# Altium project DIY_EINK_Gadget.PrjPcb
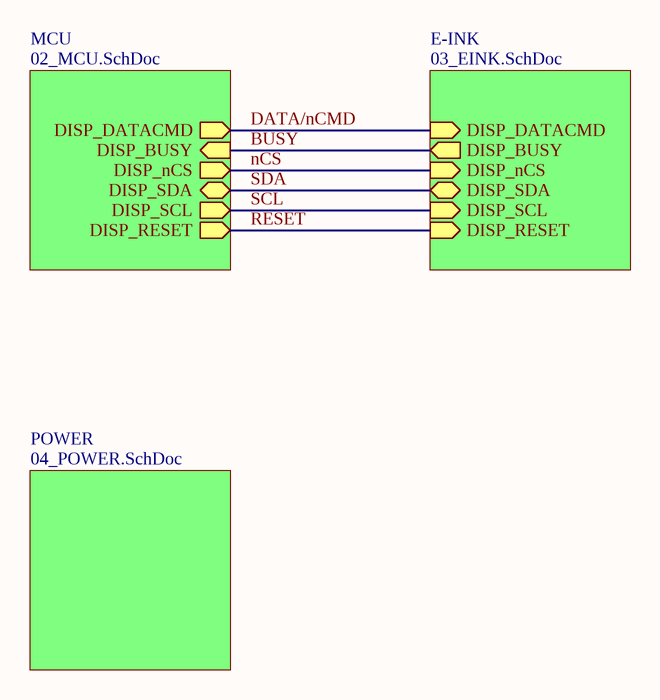
[diagram p0: 01_TOP.SchDoc]
4 sheets, 65 parts. Net scope: hierarchical (ports join the sheet entries above them; power ports are global).
Board file: DIY_EINK_Gadget.PcbDoc
Sheets:
  01_TOP.SchDoc
    MCU = 02_MCU.SchDoc
    E-INK = 03_EINK.SchDoc
    POWER = 04_POWER.SchDoc

## Sheet 01_TOP.SchDoc
size A4; Author: Sasa Karanovic; Organization: Altium Limited; DocumentNumber: 1; SheetNumber: 1; SheetTotal: 4; sk_ProjectName: DIY E-Ink Gadget; sk_title: Top page

### Sub-sheets
E-INK = 03_EINK.SchDoc: DISP_RESET (in), DISP_BUSY (out), DISP_DATACMD (in), DISP_nCS (in), DISP_SDA (bidir), DISP_SCL (in)
MCU = 02_MCU.SchDoc: DISP_SCL (out), DISP_nCS (out), DISP_BUSY (in), DISP_SDA (bidir), DISP_DATACMD (out), DISP_RESET (out)
POWER = 04_POWER.SchDoc: no entries

### Nets
BUSY: sheet MCU/DISP_BUSY, sheet E-INK/DISP_BUSY
DATA/nCMD: sheet MCU/DISP_DATACMD, sheet E-INK/DISP_DATACMD
nCS: sheet MCU/DISP_nCS, sheet E-INK/DISP_nCS
RESET: sheet MCU/DISP_RESET, sheet E-INK/DISP_RESET
SCL: sheet MCU/DISP_SCL, sheet E-INK/DISP_SCL
SDA: sheet MCU/DISP_SDA, sheet E-INK/DISP_SDA

### Notes on the sheet
- Page
- Title
- www.SasaKaranovic.com <http://www.SasaKaranovic.com>
- of

## Sheet 02_MCU.SchDoc
size A4; Author: Sasa Karanovic; Organization: Altium Limited; DocumentNumber: 1; SheetNumber: 2; SheetTotal: 4; sk_ProjectName: DIY E-Ink Gadget; sk_title: Microcontroller
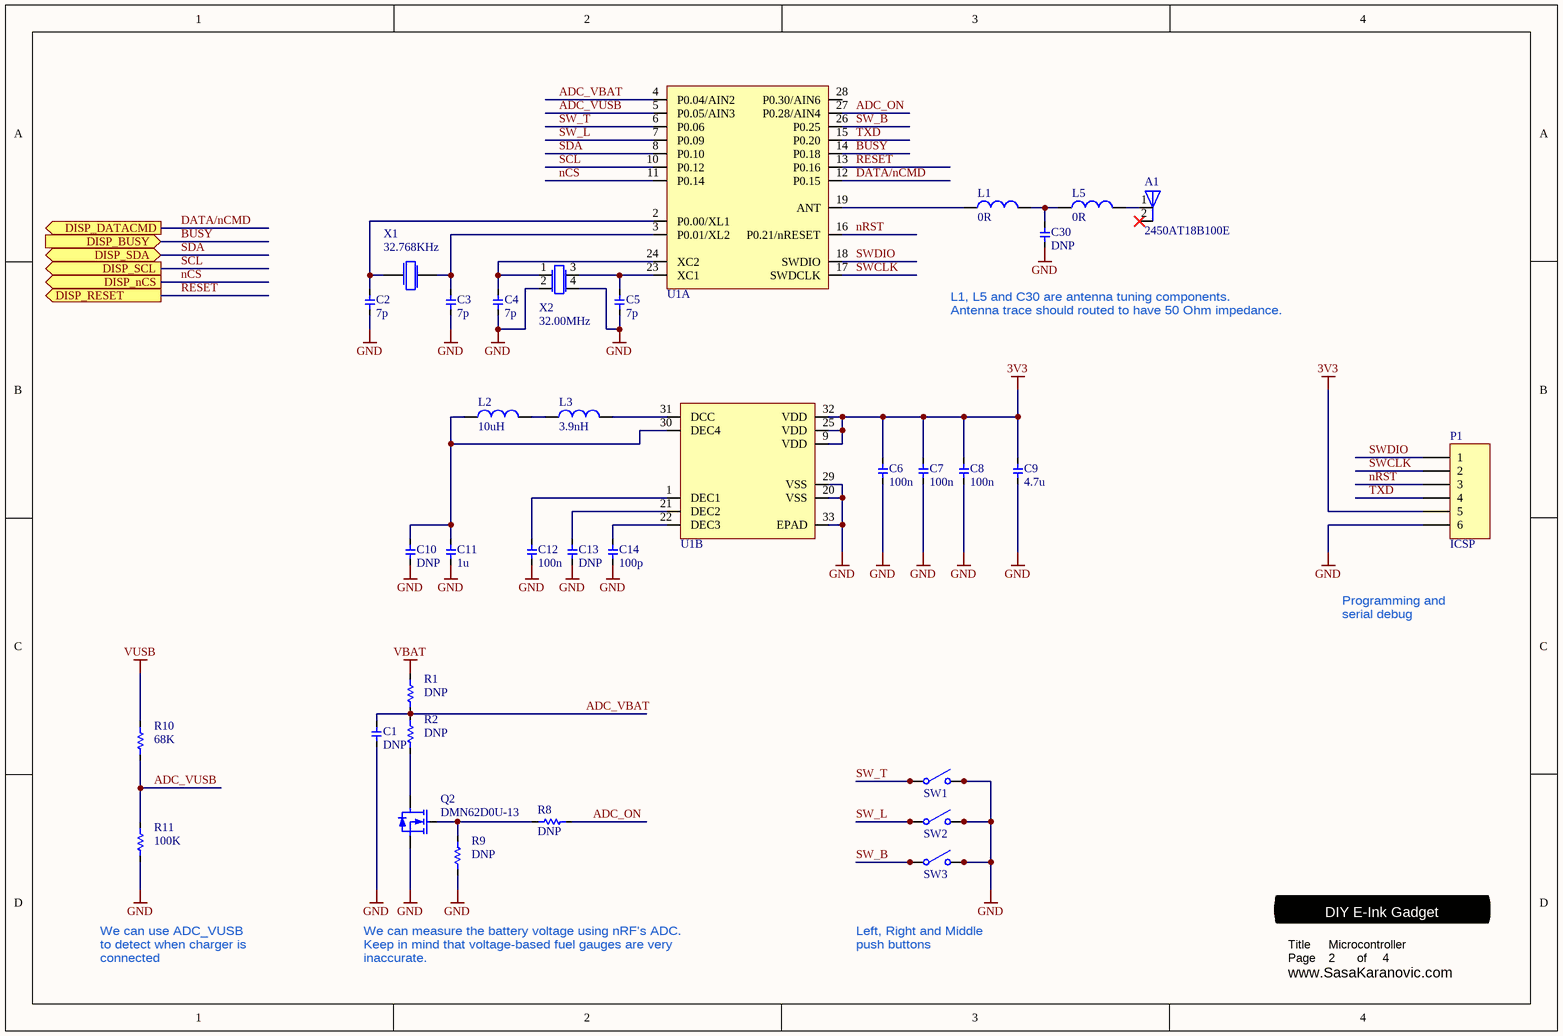
[diagram p1: 02_MCU.SchDoc]

### Parts
A1  2450AT18B100E  [2450AT18B100]
C1  value DNP  [0603 - CAP]  (hidden comment: Cap)  (no BOM)
C2  value 7p  [0603 - CAP]  (hidden comment: Cap)
C3  value 7p  [0603 - CAP]  (hidden comment: Cap)
C4  value 7p  [0603 - CAP]  (hidden comment: Cap)
C5  value 7p  [0603 - CAP]  (hidden comment: Cap)
C6  value 100n  [0603 - CAP]  (hidden comment: Cap)
C7  value 100n  [0603 - CAP]  (hidden comment: Cap)
C8  value 100n  [0603 - CAP]  (hidden comment: Cap)
C9  value 4.7u  [0603 - CAP]  (hidden comment: Cap)
C10  value DNP  [0603 - CAP]  (hidden comment: Cap)  (no BOM)
C11  value 1u  [0603 - CAP]  (hidden comment: Cap)
C12  value 100n  [0603 - CAP]  (hidden comment: Cap)
C13  value DNP  [0603 - CAP]  (hidden comment: Cap)  (no BOM)
C14  value 100p  [0603 - CAP]  (hidden comment: Cap)
C30  value DNP  [0603 - CAP]  (hidden comment: Cap)  (no BOM)
L1  value 0R  [0603_IND]  (hidden comment: Inductor)
L2  value 10uH  [0603_IND]  (hidden comment: Inductor)
L3  value 3.9nH  [0603_IND]  (hidden comment: Inductor)
L5  value 0R  [0603_IND]  (hidden comment: Inductor)
P1  ICSP  [Header 6x1 M - 90Deg - SMT]  (no BOM)
Q2  DMN62D0U-13  [SOT90P240X100-3N]  (no BOM)
R1  value DNP  [0603]  (hidden comment: Res)  (no BOM)
R2  value DNP  [0603]  (hidden comment: Res)  (no BOM)
R8  value DNP  [0603]  (hidden comment: Res)  (no BOM)
R9  value DNP  [0603]  (hidden comment: Res)  (no BOM)
R10  value 68K  [0603]  (hidden comment: Res)
R11  value 100K  [0603]  (hidden comment: Res)
SW1  SWITCH TACTILE SPST-NO 0.05A 12V  [PTS645]  (value not drawn)
SW2  SWITCH TACTILE SPST-NO 0.05A 12V  [PTS645]  (value not drawn)
SW3  SWITCH TACTILE SPST-NO 0.05A 12V  [PTS645]  (value not drawn)
U1  NRF52810-QCAA-R  [QFN50P500X500X100_HS-33N]  (value not drawn)  (parts A,B of 2)
X1  32.768KHz  [XTAL-2LEAD-3215]
X2  32.00MHz  [XTAL-4LEAD-2016]

### Ports
DISP_BUSY (in), DISP_DATACMD (out), DISP_nCS (out), DISP_RESET (out), DISP_SCL (out), DISP_SDA (bidir)

### Nets
3V3: C6.2 C7.2 C8.2 C9.2 P1.5 U1.9(VDD) U1.25(VDD) U1.32(VDD)
GND: C1.1 C2.1 C3.1 C4.1 C5.1 C6.1 C7.1 C8.1 C9.1 C10.1 C11.1 C12.1 C13.1 C14.1 C30.1 P1.6 Q2.2(S) R9.1 R11.1 SW1.3(COMMON2) SW1.4(COMMON2) SW2.3(COMMON2) SW2.4(COMMON2) SW3.3(COMMON2) SW3.4(COMMON2) U1.20(VSS) U1.29(VSS) U1.33(EPAD) X2.2(GND) X2.4(GND)
VBAT: R1.2
VUSB: R10.2
ADC_ON: R8.1 U1.27(P0.28/AIN4)
ADC_VBAT: C1.2 R1.1 R2.2 U1.4(P0.04/AIN2)
ADC_VUSB: R10.1 R11.2 U1.5(P0.05/AIN3)
BUSY: U1.14(P0.18) ; port DISP_BUSY
DATA/nCMD: U1.12(P0.15) ; port DISP_DATACMD
nCS: U1.11(P0.14) ; port DISP_nCS
nRST: P1.3 U1.16(P0.21/nRESET)
RESET: U1.13(P0.16) ; port DISP_RESET
SCL: U1.10(P0.12) ; port DISP_SCL
SDA: U1.8(P0.10) ; port DISP_SDA
SW_B: SW3.1(COMMON1) SW3.2(COMMON1) U1.26(P0.25)
SW_L: SW2.1(COMMON1) SW2.2(COMMON1) U1.7(P0.09)
SW_T: SW1.1(COMMON1) SW1.2(COMMON1) U1.6(P0.06)
SWCLK: P1.2 U1.17(SWDCLK)
SWDIO: P1.1 U1.18(SWDIO)
TXD: P1.4 U1.15(P0.20)
NetA1_1: A1.1(FEED) L5.2
NetC2_2: C2.2 U1.2(P0.00/XL1) X1.1
NetC3_2: C3.2 U1.3(P0.01/XL2) X1.2
NetC4_2: C4.2 U1.24(XC2) X2.1(OSC1)
NetC5_2: C5.2 U1.23(XC1) X2.3(OSC3)
NetC10_2: C10.2 C11.2 L2.1 U1.30(DEC4)
NetC12_2: C12.2 U1.1(DEC1)
NetC13_2: C13.2 U1.21(DEC2)
NetC14_2: C14.2 U1.22(DEC3)
NetC30_2: C30.2 L1.2 L5.1
NetL1_1: L1.1 U1.19(ANT)
NetL2_2: L2.2 L3.1
NetL3_2: L3.2 U1.31(DCC)
NetQ2_1: Q2.1(G) R8.2 R9.2
NetQ2_3: Q2.3(D) R2.1

Not connected (* = marked no-connect by the designer): A1 2(NC)*; U1 28(_P0.30/AIN6)

### Notes on the sheet
- L1, L5 and C30 are antenna tuning components.
  Antenna trace should routed to have 50 Ohm impedance.
- Programming and serial debug
- We can use ADC_VUSB to detect when charger is connected
- We can measure the battery voltage using nRF's ADC.
  Keep in mind that voltage-based fuel gauges are very inaccurate.
- Left, Right and Middle push buttons
- Page
- Title
- www.SasaKaranovic.com <http://www.SasaKaranovic.com>
- of

### Library data of the parts
A1 = 2450AT18B100E: 2.4GHz - Chip RF Antenna 2.4GHz ~ 2.5GHz 0.5dBi Solder Surface Mount; Manufacturer: Johanson Technology Inc.; Manufacturer Part Number: 2450AT18B100E; Distributor: DigiKey; Distributor Part Number: 712-1006-1-ND
C1 C10 C13 C30 = Cap: Capacitor
C2-C5 = Cap: Capacitor; Manufacturer: Samsung Electro-Mechanics; Manufacturer Part Number: CL10C070DB8NNNC; Distributor Part Number: 1276-2138-1-ND; Distributor: DigiKey
C6-C8 C12 = Cap: Capacitor; Manufacturer: Samsung Electro-Mechanics; Manufacturer Part Number: CL10B104KB8NNWC; Distributor Part Number: 1276-1935-1-ND; Distributor: DigiKey
C9 = Cap: Capacitor; Manufacturer: Samsung Electro-Mechanics; Manufacturer Part Number: CL10B475KQ8NQNC; Distributor Part Number: 1276-2087-1-ND; Distributor: DigiKey
C11 = Cap: Capacitor; Manufacturer: Samsung Electro-Mechanics; Manufacturer Part Number: CL10B105KA8VPNC; Distributor Part Number: 1276-6617-1-ND; Distributor: DigiKey
C14 = Cap: Capacitor; Manufacturer: Samsung Electro-Mechanics; Manufacturer Part Number: CL10C101JB8NNNC; Distributor Part Number: 1276-1008-1-ND; Distributor: DigiKey
L1 L5 = Inductor: Manufacturer: YAGEO; Manufacturer Part Number: RC0603FR-070RL; Distributor: DigiKey; Distributor Part Number: 311-0.0HRCT-ND
L2 = Inductor: Manufacturer: Abracon LLC; Manufacturer Part Number: ASMCI-0603-100M-T; Distributor: DigiKey; Distributor Part Number: 535-12249-1-ND
L3 = Inductor: Manufacturer: Abracon LLC; Manufacturer Part Number: AIMC-0603-3N9S-T; Distributor: DigiKey; Distributor Part Number: 535-11540-1-ND
P1 = Header 6: Header, 6-Pin
Q2 = DMN62D0U-13: MOSFET N-CH 60V 0.38A; Manufacturer: Diodes Incorporated; Manufacturer Part Number: DMN62D0U-13; Distributor: DigiKey; Distributor Part Number: DMN62D0U-13DICT-ND
R1 R2 R8 R9 = Res: Resistor
R10 = Res: Resistor; Manufacturer: YAGEO; Manufacturer Part Number: RC0603FR-0768KL; Distributor: DigiKey; Distributor Part Number: 311-68.0KHRCT-ND
R11 = Res: Resistor; Manufacturer: YAGEO; Manufacturer Part Number: RC0603FR-07100KL; Distributor: DigiKey; Distributor Part Number: 311-100KHRCT-ND
SW1-SW3 = PTS645SL50SMTR92 LFS: Manufacturer: C&K; Distributor Part Number: CKN9088CT-ND; Manufacturer Part Number: PTS645SL50SMTR92 LFS; Distributor: DigiKey
U1 = NRF52810-QCAA-R: IC RF TxRx + MCU Bluetooth Bluetooth v5.0 2.4GHz 32-VFQFN Exposed Pad; Manufacturer: Nordic Semiconductor ASA; Manufacturer Part Number: NRF52810-QCAA-R; Distributor: DigiKey; Distributor Part Number: 1490-NRF52810-QCAA-RCT-ND
X1 = XTAL-32.768KHz-SC32S-7PF20PPM: 32.768 kHz ±20ppm Crystal 7pF 70 kOhms 2-SMD, No Lead; Manufacturer: ECS Inc.; Manufacturer Part Number: ECS-320-8-37B-CKY-TR; Distributor: DigiKey; Distributor Part Number: XC3067CT-ND
X2 = XTAL-32MHz-ECS-320-8-37B-CKY-TR: 32 MHz ±10ppm Crystal 8pF 50 Ohms 4-SMD, No Lead; Manufacturer: ECS Inc.; Manufacturer Part Number: ECS-320-8-37B-CKY-TR; Distributor: DigiKey; Distributor Part Number: XC3067CT-ND

## Sheet 03_EINK.SchDoc
size A4; Author: Sasa Karanovic; Organization: Altium Limited; DocumentNumber: 1; SheetNumber: 3; SheetTotal: 4; sk_ProjectName: DIY E-Ink Gadget; sk_title: E-Ink Driving Circuit
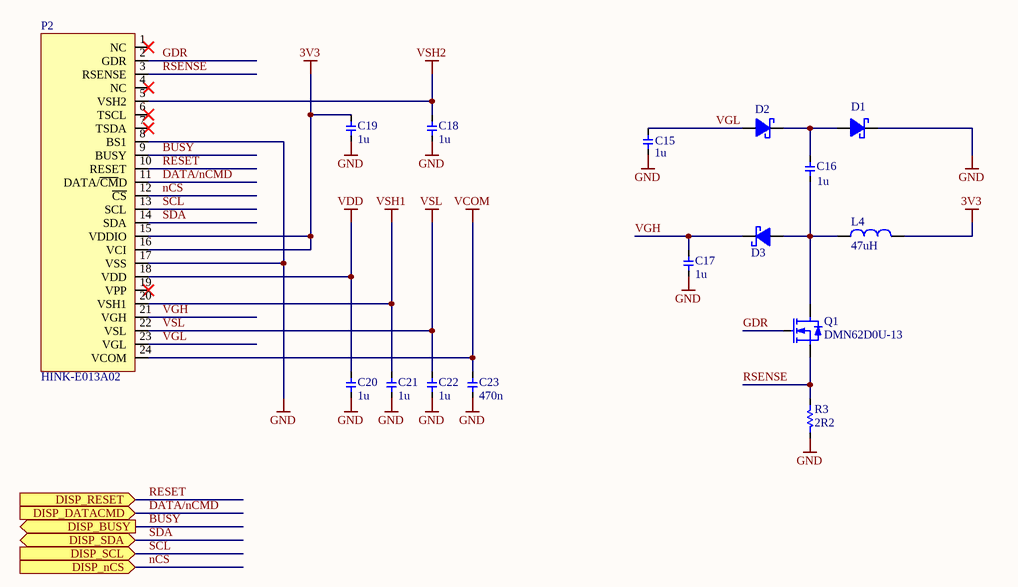
[diagram p2: 03_EINK.SchDoc]

### Parts
C15  value 1u  [0603 - CAP HS]  (hidden comment: Cap)
C16  value 1u  [0603 - CAP HS]  (hidden comment: Cap)
C17  value 1u  [0603 - CAP HS]  (hidden comment: Cap)
C18  value 1u  [0603 - CAP HS]  (hidden comment: Cap)
C19  value 1u  [0603 - CAP HS]  (hidden comment: Cap)
C20  value 1u  [0603 - CAP HS]  (hidden comment: Cap)
C21  value 1u  [0603 - CAP HS]  (hidden comment: Cap)
C22  value 1u  [0603 - CAP HS]  (hidden comment: Cap)
C23  value 470n  [0603 - CAP HS]  (hidden comment: Cap)
D1  Diode Schotky  [SOD123F]  (value not drawn)
D2  Diode Schotky  [SOD123F]  (value not drawn)
D3  Diode Schotky  [SOD123F]  (value not drawn)
L4  value 47uH  [IND_5050]  (hidden comment: Inductor)
P2  HINK-E013A02  [SFV24R-1STE1HLF]
Q1  DMN62D0U-13  [SOT90P240X100-3N]
R3  value 2R2  [0603 - HS]  (hidden comment: Res)

### Ports
DISP_BUSY (out), DISP_DATACMD (in), DISP_nCS (in), DISP_RESET (in), DISP_SCL (in), DISP_SDA (bidir)

### Nets
3V3: C19.2 L4.1 P2.15(VDDIO) P2.16(VCI)
GND: C15.2 C17.2 C18.1 C19.1 C20.1 C21.1 C22.1 C23.1 D1.K P2.8(BS1) P2.17(VSS) R3.2
VCOM: C23.2 P2.24(VCOM)
VDD: C20.2 P2.18(VDD)
VSH1: C21.2 P2.20(VSH1)
VSH2: C18.2 P2.5(VSH2)
VSL: C22.2 P2.22(VSL)
BUSY: P2.9(BUSY) ; port DISP_BUSY
DATA/nCMD: P2.11(DATA/~{CM}D) ; port DISP_DATACMD
GDR: P2.2(GDR) Q1.1(G)
nCS: P2.12(~{CS}) ; port DISP_nCS
RESET: P2.10(RESET) ; port DISP_RESET
RSENSE: P2.3(RSENSE) Q1.2(S) R3.1
SCL: P2.13(SCL) ; port DISP_SCL
SDA: P2.14(SDA) ; port DISP_SDA
VGH: C17.1 D3.K P2.21(VGH)
VGL: C15.1 D2.A P2.23(VGL)
NetC16_1: C16.1 D3.A L4.2 Q1.3(D)
NetC16_2: C16.2 D1.A D2.K

Not connected (* = marked no-connect by the designer): P2 1(NC)* 4(NC)* 6(TSCL)* 7(TSDA)* 19(VPP)*

### Notes on the sheet
- Page
- Title
- www.SasaKaranovic.com <http://www.SasaKaranovic.com>
- of

### Library data of the parts
C15-C22 = Cap: as C11 on sheet 02_MCU; Distributor Part Number: 1276-6617-1-ND; Distributor: DigiKey
C23 = Cap: Capacitor; Manufacturer: Samsung Electro-Mechanics; Manufacturer Part Number: CL10B474KA8NNNC; Distributor Part Number: 1276-2083-1-ND; Distributor: DigiKey
D1-D3 = Diode Schotky: Manufacturer: onsemi; Manufacturer Part Number: NRVB130LSFT1G; Distributor: DigiKey; Distributor Part Number: NRVB130LSFT1GOSCT-ND
L4 = Inductor: Manufacturer: TDK Corporation; Manufacturer Part Number: VLCF5024T-470MR40-2; Distributor: DigiKey; Distributor Part Number: 445-8747-1-ND
P2 = SFV24R-1STE1HLF: Manufacturer: Amphenol ICC (FCI); Manufacturer Part Number: SFV24R-4STE1HLF; Distributor: DigiKey; Distributor Part Number: 609-SFV24R-4STE1HLFCT-ND
Q1 = DMN62D0U-13: as Q2 on sheet 02_MCU; Manufacturer Part Number: DMN62D0U-13; Distributor: DigiKey; Distributor Part Number: DMN62D0U-13DICT-ND
R3 = Res: Resistor; Manufacturer: YAGEO; Manufacturer Part Number: RC0603FR-072R2L; Distributor: DigiKey; Distributor Part Number: 311-2.2HRCT-ND

## Sheet 04_POWER.SchDoc
size A4; Author: Sasa Karanovic; Organization: Altium Limited; DocumentNumber: 1; SheetNumber: 4; SheetTotal: 4; sk_ProjectName: DIY E-Ink Gadget; sk_title: Power and Battery Charging
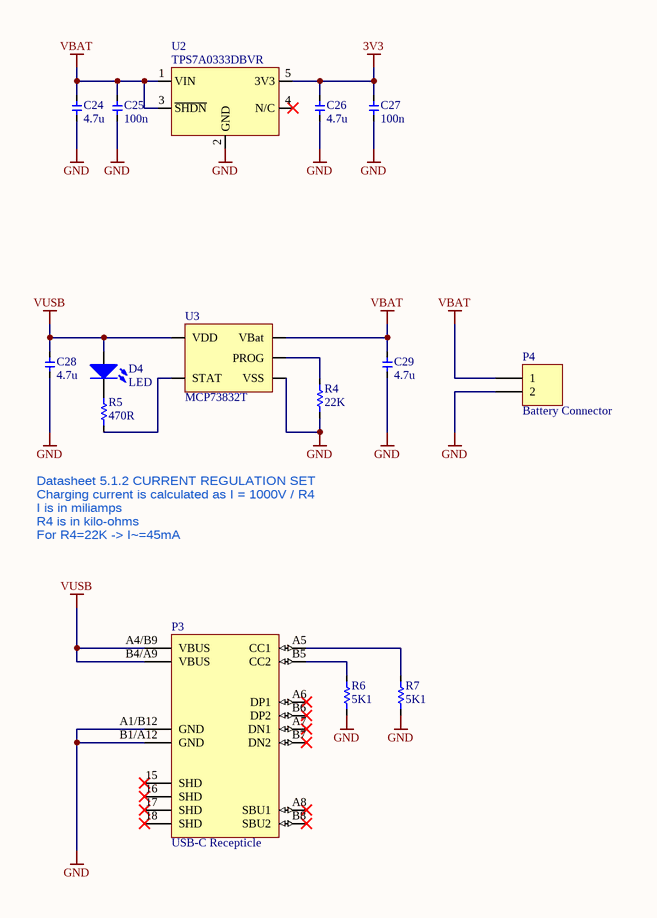
[diagram p3: 04_POWER.SchDoc]

### Parts
C24  value 4.7u  [0603 - CAP HS]  (hidden comment: Cap)
C25  value 100n  [0603 - CAP HS]  (hidden comment: Cap)
C26  value 4.7u  [0603 - CAP HS]  (hidden comment: Cap)
C27  value 100n  [0603 - CAP HS]  (hidden comment: Cap)
C28  value 4.7u  [0603 - CAP HS]  (hidden comment: Cap)
C29  value 4.7u  [0603 - CAP HS]  (hidden comment: Cap)
D4  LED  [0603 Diode]
P3  USB-C Recepticle  [GCT_USB4105-GF-A]
P4  Battery Connector  [Header 2x1 SMD]  (no BOM)
R4  value 22K  [0603]  (hidden comment: Res)
R5  value 470R  [0603]  (hidden comment: Res)
R6  value 5K1  [0603]  (hidden comment: Res)
R7  value 5K1  [0603]  (hidden comment: Res)
U2  TPS7A0333DBVR  [SOT-23-5]
U3  MCP73832T  [SOT-23-5]

### Nets
3V3: C26.1 C27.1 U2.5(3V3)
GND: C24.2 C25.2 C26.2 C27.2 C28.2 C29.2 P3.A1/B12(GND) P3.B1/A12(GND) P4.2 R4.1 R6.1 R7.1 U2.2(GND) U3.2(VSS)
VBAT: C24.1 C25.1 C29.1 P4.1 U2.1(VIN) U2.3(~{SHDN}) U3.3(VBat)
VUSB: C28.1 D4.A P3.A4/B9(VBUS) P3.B4/A9(VBUS) U3.4(VDD)
NetD4_K: D4.K R5.2
NetP3_A5: P3.A5(CC1) R7.2
NetP3_B5: P3.B5(CC2) R6.2
NetR4_2: R4.2 U3.5(PROG)
NetR5_1: R5.1 U3.1(STAT)

Not connected (* = marked no-connect by the designer): P3 15(SHD)* 16(SHD)* 17(SHD)* 18(SHD)* A6(DP1)* A7(DN1)* A8(SBU1)* B6(DP2)* B7(DN2)* B8(SBU2)*; U2 4(N/C)*

### Notes on the sheet
- Datasheet 5.1.2 CURRENT REGULATION SET
  Charging current is calculated as I = 1000V / R4
  I is in miliamps
  R4 is in kilo-ohms
  For R4=22K -> I~=45mA
- Page
- Title
- www.SasaKaranovic.com <http://www.SasaKaranovic.com>
- of

### Library data of the parts
C24 C26 C28 C29 = Cap: as C9 on sheet 02_MCU; Distributor Part Number: 1276-2087-1-ND; Distributor: DigiKey
C25 C27 = Cap: as C6 on sheet 02_MCU; Distributor Part Number: 1276-1935-1-ND; Distributor: DigiKey
D4 = LED: Typical RED GaAs LED; Manufacturer: Lite-On Inc.; Manufacturer Part Number: LTST-C193KRKT-5A; Distributor: DigiKey; Distributor Part Number: Lite-On Inc.
P3 = USB-C Recepticle: CONN RCPT USB2.0 TYPEC 5A; Manufacturer: GCT; Manufacturer Part Number: USB4105-GF-A; Distributor Part Number: 2073-USB4105-GF-ACT-ND; Distributor: DigiKey
P4 = Header 2: Header, 2-Pin
R4 = Res: Resistor; Manufacturer: YAGEO; Manufacturer Part Number: AC0603FR-1022KL; Distributor: DigiKey; Distributor Part Number: 13-AC0603FR-1022KLCT-ND
R5 = Res: Resistor; Manufacturer: YAGEO; Manufacturer Part Number: RC0603FR-10470RL; Distributor: DigiKey; Distributor Part Number: 13-RC0603FR-10470RLCT-ND
R6 R7 = Res: Resistor; Manufacturer: YAGEO; Manufacturer Part Number: RC0603FR-135K1L; Distributor: DigiKey; Distributor Part Number: 13-RC0603FR-135K1LCT-ND
U2 = NCP161ASN330T1G: Linear Voltage Regulator IC  1 Output  450mA SOT-23-5; Manufacturer: ON Semiconductor; Distributor: DigiKey; Distributor Part Number: NCP161ASN330T1GOSCT-ND; Manufacturer Part Number: NCP161ASN330T1G
U3 = MCP73832: 1xLi-Ion char, 0.5A, 4.2V reg, 3.75-6V; Manufacturer: Microchip Technology; Manufacturer Part Number: MCP73832T-2ACI/OT; Distributor: DigiKey; Distributor Part Number: MCP73832T-2ACI/OTCT-ND

## Nets that join several sheets
3V3: 02_MCU (8 pins), 03_EINK (C19.2 L4.1 P2.15 P2.16), 04_POWER (C26.1 C27.1 U2.5)
GND: 02_MCU (30 pins), 03_EINK (12 pins), 04_POWER (14 pins)
VBAT: 02_MCU (R1.2), 04_POWER (7 pins)
VUSB: 02_MCU (R10.2), 04_POWER (5 pins)
BUSY: 02_MCU (U1.14), 03_EINK (P2.9)
DATA/nCMD: 02_MCU (U1.12), 03_EINK (P2.11)
nCS: 02_MCU (U1.11), 03_EINK (P2.12)
RESET: 02_MCU (U1.13), 03_EINK (P2.10)
SCL: 02_MCU (U1.10), 03_EINK (P2.13)
SDA: 02_MCU (U1.8), 03_EINK (P2.14)